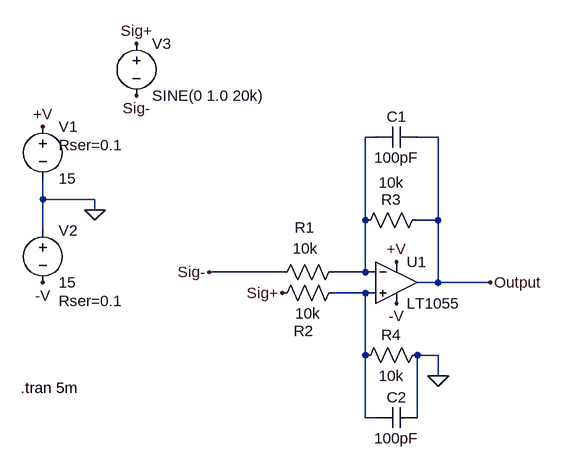
[diagram p0: schematic Balanced to Unbalanced Converter.asc]
Balanced to Unbalanced Converter.asc, the LTspice schematic file:
Version 4
SHEET 1 880 680
WIRE 144 -80 128 -80
WIRE 240 -80 208 -80
WIRE -368 16 -368 -16
WIRE -288 16 -368 16
WIRE -288 32 -288 16
WIRE 128 48 128 -80
WIRE 240 48 240 -80
WIRE 240 48 208 48
WIRE -368 64 -368 16
WIRE 0 128 -112 128
WIRE 128 128 128 48
WIRE 128 128 80 128
WIRE 144 128 128 128
WIRE 240 144 240 48
WIRE 240 144 208 144
WIRE 320 144 240 144
WIRE 128 160 80 160
WIRE 144 160 128 160
WIRE 128 256 128 160
WIRE 240 256 208 256
WIRE 240 288 240 256
WIRE 128 352 128 256
WIRE 144 352 128 352
WIRE 208 352 208 256
FLAG 320 144 Output
FLAG -288 32 0
FLAG -368 -96 +V
FLAG 176 112 +V
FLAG -368 144 -V
FLAG 176 176 -V
FLAG -224 -224 Sig+
FLAG 0 160 Sig+
FLAG -224 -144 Sig-
FLAG -112 128 Sig-
FLAG 240 288 0
SYMBOL OpAmps\\LT1055 176 80 R0
SYMATTR InstName U1
SYMBOL res 96 112 R90
WINDOW 0 -37 61 VBottom 2
WINDOW 3 -36 60 VTop 2
SYMATTR InstName R1
SYMATTR Value 10k
SYMBOL res 96 144 R90
WINDOW 0 90 63 VBottom 2
WINDOW 3 32 56 VTop 2
SYMATTR InstName R2
SYMATTR Value 10k
SYMBOL res 224 32 R90
WINDOW 0 0 56 VBottom 2
WINDOW 3 -58 56 VTop 2
SYMATTR InstName R3
SYMATTR Value 10k
SYMBOL res 224 240 R90
WINDOW 0 0 56 VBottom 2
WINDOW 3 32 56 VTop 2
SYMATTR InstName R4
SYMATTR Value 10k
SYMBOL voltage -368 -112 R0
WINDOW 123 0 0 Left 0
WINDOW 39 24 44 Left 2
SYMATTR InstName V1
SYMATTR Value 15
SYMATTR SpiceLine Rser=0.1
SYMBOL voltage -368 48 R0
WINDOW 123 0 0 Left 0
WINDOW 39 24 124 Left 2
SYMATTR InstName V2
SYMATTR Value 15
SYMATTR SpiceLine Rser=0.1
SYMBOL voltage -224 -240 R0
WINDOW 123 0 0 Left 0
WINDOW 39 0 0 Left 0
SYMATTR InstName V3
SYMATTR Value SINE(0 1.0 20k)
SYMBOL cap 208 -96 R90
WINDOW 0 0 32 VBottom 2
WINDOW 3 32 32 VTop 2
SYMATTR InstName C1
SYMATTR Value 100pF
SYMBOL cap 208 336 R90
WINDOW 0 0 32 VBottom 2
WINDOW 3 32 32 VTop 2
SYMATTR InstName C2
SYMATTR Value 100pF
TEXT -402 306 Left 2 !.tran 5m

The netlist it stands for:
* Balanced to Unbalanced Converter.asc
XU1 N002 N001 +V -V Output LT1055  ; pins In+ In- V+ V- OUT
R1 N001 Sig- 10k
R2 N002 Sig+ 10k
R3 Output N001 10k
R4 0 N002 10k
V1 +V 0 15 Rser=0.1
V2 0 -V 15 Rser=0.1
V3 Sig+ Sig- SINE(0 1.0 20k)
C1 Output N001 100pF
C2 0 N002 100pF
.tran 5m
.backanno
.end